# EasyEDA Pro project ProDocument_Schematics_2024-05-18.epro

# Schematic FAB-O-MATIC
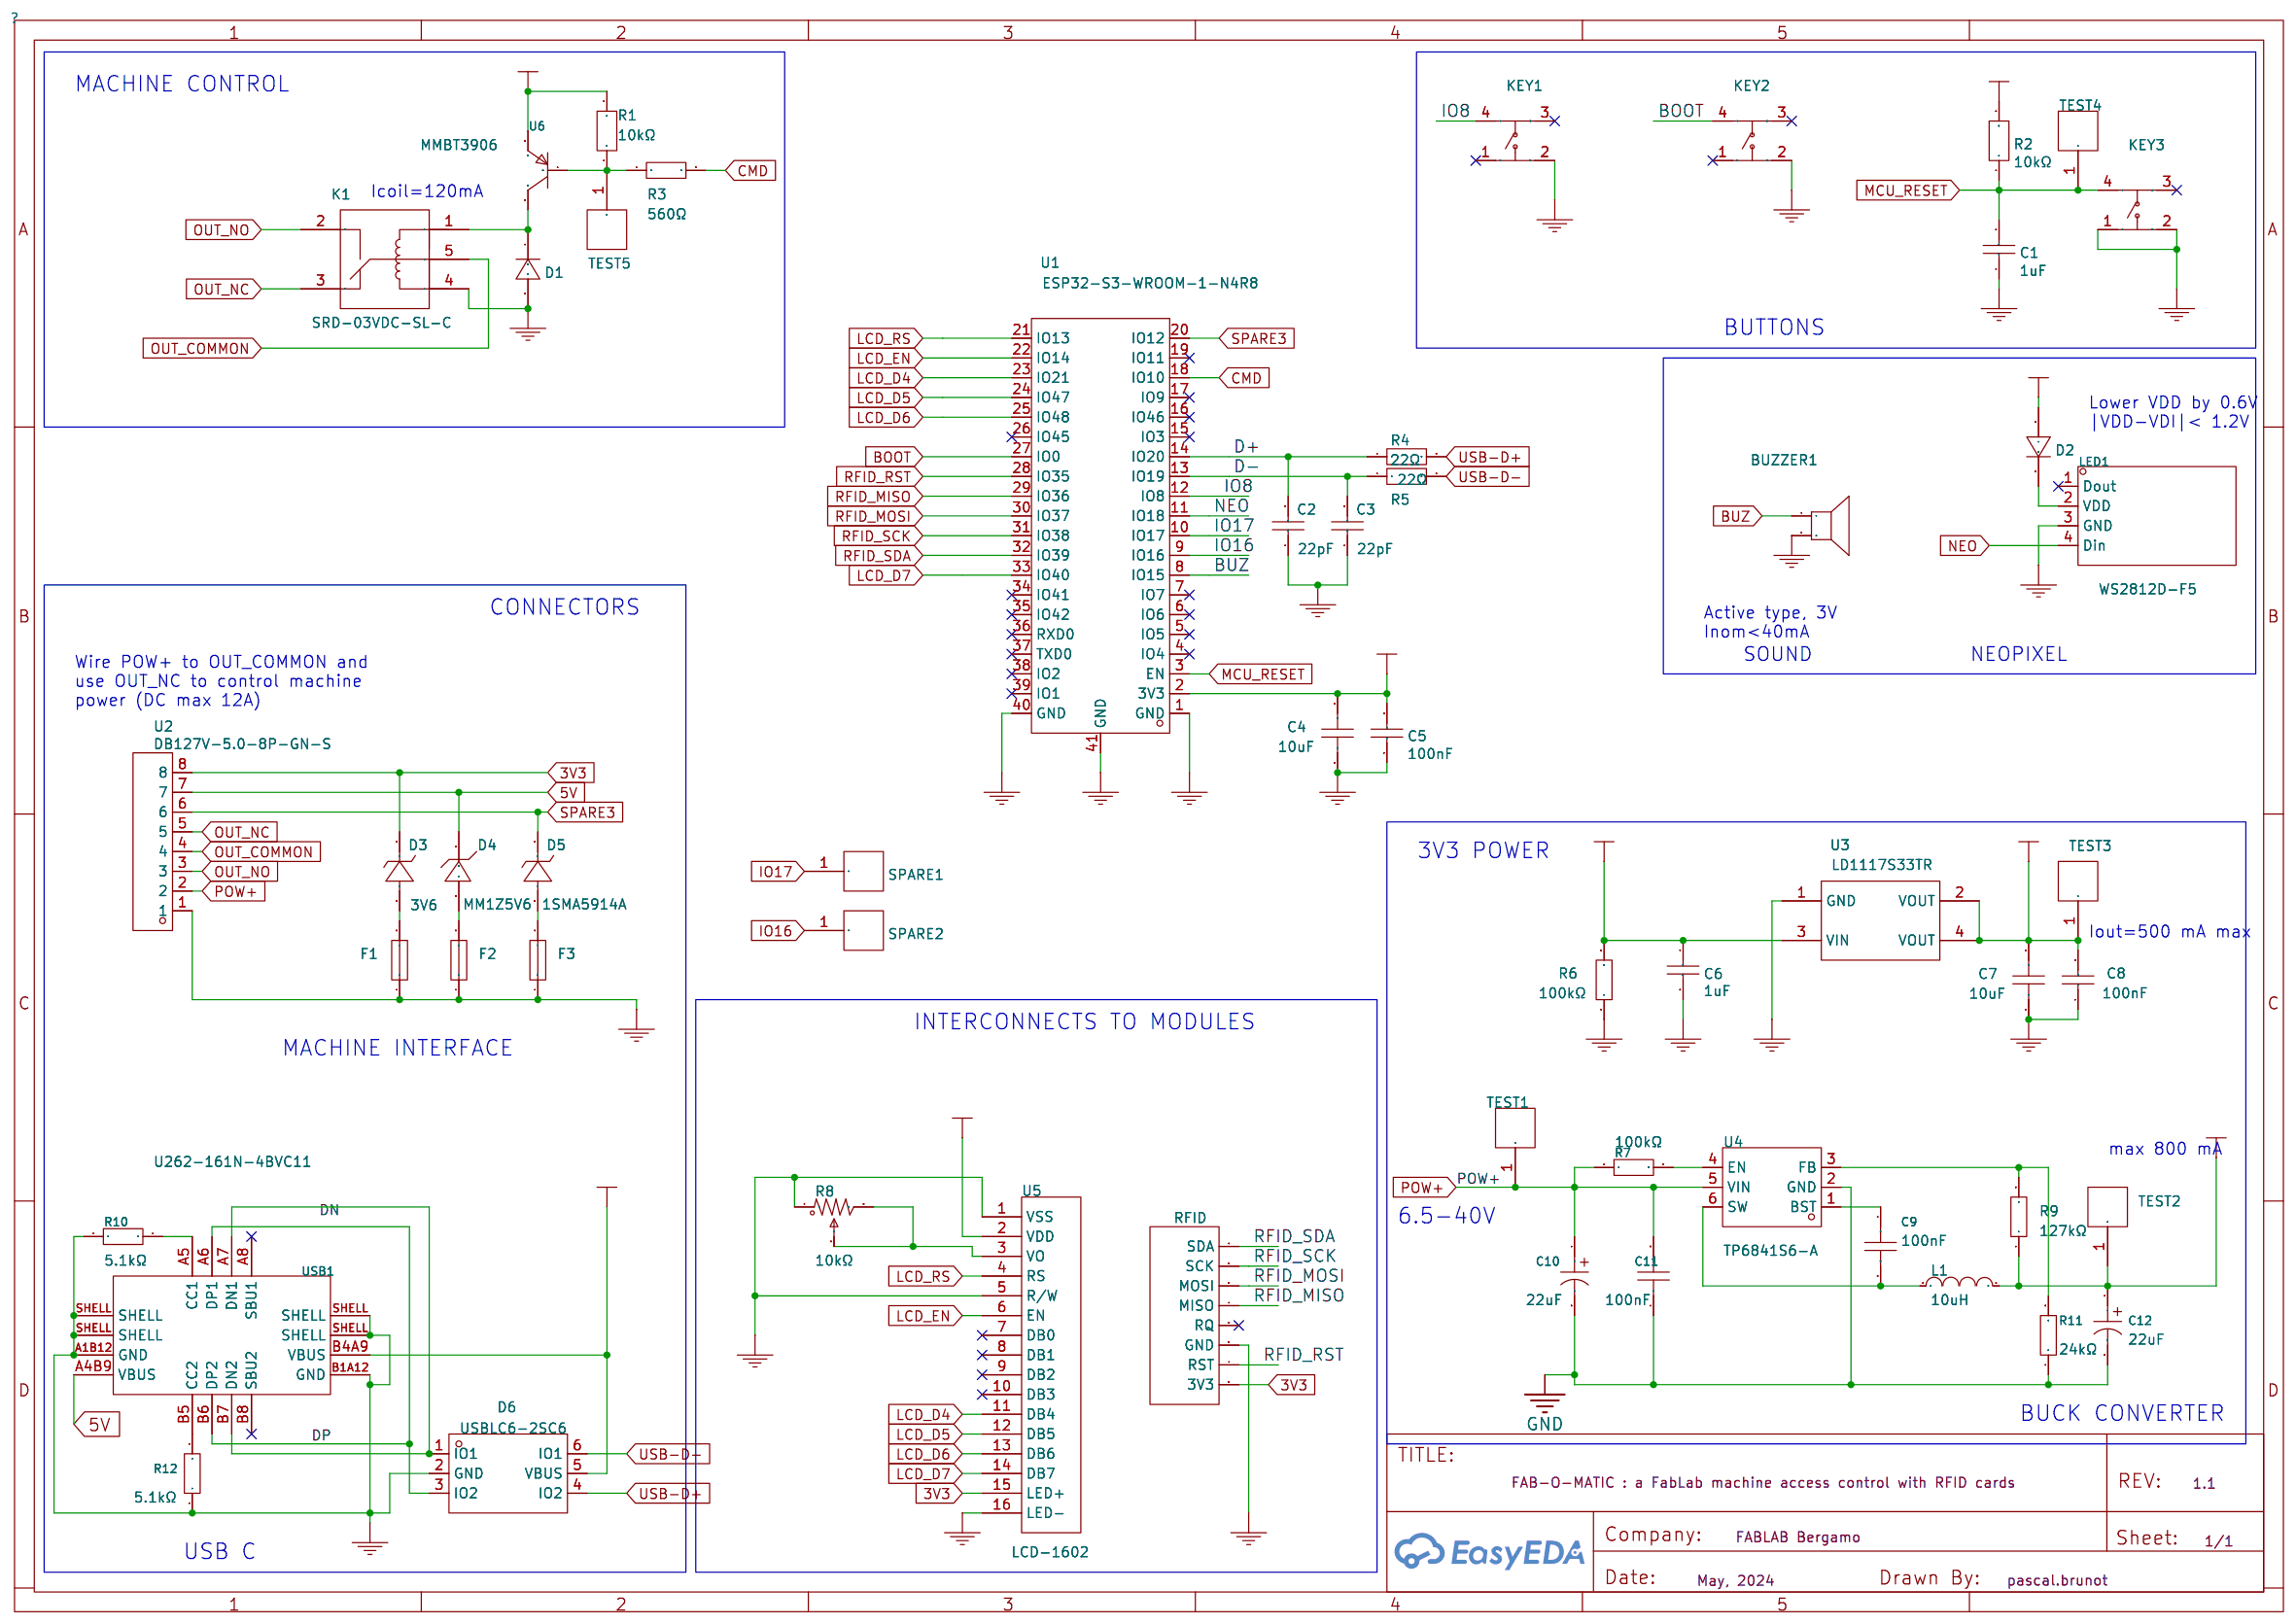
[diagram p0: schematic sheet]

## Parts
BUZZER1  4kHz  [BUZ-TH_BD12.5-P6.50-D0.9]
C1  1uF  [C0805]
C2  22pF  [C0603]
C3  22pF  [C0603]
C4  10uF  [C0805]
C5  100nF  [C0805]
C6  1uF  [C0805]
C7  10uF  [C0805]
C8  100nF  [C0805]
C9  100nF  [C0603]
C10  22uF  [CAP-SMD_BD6.3-L6.6-W6.6-FD]
C11  100nF  [C0603]
C12  22uF  [CAP-SMD_BD6.3-L6.6-W6.6-FD]
D1  SM4007PL  [SOD-123F_L2.8-W1.8-LS3.7-RD]
D2  SM4007PL  [SOD-123F_L2.8-W1.8-LS3.7-RD]
D3  3V6  [SMA_L4.4-W2.6-LS5.1-RD]
D4  MM1Z5V6  [SOD-123_L2.8-W1.8-LS3.7-RD]
D5  1SMA5914A  [SMA_L4.4-W2.6-LS5.1-RD]
D6  USBLC6-2SC6  [SOT-23-6_L2.9-W1.6-P0.95-LS2.8-BL]
F1  1206L016WR  [F1206]
F2  1206L016WR  [F1206]
F3  1206L016WR  [F1206]
K1  SRD-03VDC-SL-C  [RELAY-TH_SRD-03VDC-SL-C]
KEY1  TSA063G60-250  [KEY-SMD_4P-L6.1-W6.1-P4.50-LS9.0]
KEY2  TSA063G60-250  [KEY-SMD_4P-L6.1-W6.1-P4.50-LS9.0]
KEY3  TSA063G60-250  [KEY-SMD_4P-L6.1-W6.1-P4.50-LS9.0]
L1  10uH  [IND-SMD_L4.0-W4.0]
LED1  WS2812D-F5  [LED-TH_4P-BD5.8-P1.30]
P1  RFID  [footprint_17af]
R1  10kΩ  [R0805]
R2  10kΩ  [R0805]
R3  560Ω  [R0805]
R4  22Ω  [R0603]
R5  22Ω  [R0603]
R6  100kΩ  [R0805]
R7  100kΩ  [R0603]
R8  10kΩ  [RES-ADJ-TH_3362P]
R9  127kΩ  [R0603]
R10  5.1kΩ  [R0603]
R11  24kΩ  [R0603]
R12  5.1kΩ  [R0603]
SPARE1  0577-0-43-80-21-27-10-0  [footprint_662d]  (no BOM)
SPARE2  0577-0-43-80-21-27-10-0  [footprint_662d]  (no BOM)
TEST1  0577-0-43-80-21-27-10-0  [footprint_662d]  (no BOM)
TEST2  0577-0-43-80-21-27-10-0  [footprint_662d]  (no BOM)
TEST3  0577-0-43-80-21-27-10-0  [footprint_662d]  (no BOM)
TEST4  0577-0-43-80-21-27-10-0  [footprint_662d]  (no BOM)
TEST5  0577-0-43-80-21-27-10-0  [footprint_662d]  (no BOM)
U1  ESP32-S3-WROOM-1-N4R8  [WIRELM-SMD_ESP32-S3-WROOM-1]
U2  DB127V-5.0-8P-GN-S  [CONN-TH_8P-P5.00_DB127V-5.0-8P-GN-S]
U3  LD1117S33TR  [SOT-223_L6.5-W3.5-P2.30-LS7.0-BR]
U4  TP6841S6-A  [SOT-23-6_L2.9-W1.6-P0.95-LS2.8-BL]
U5  LCD-1602  [footprint_8a57]
U6  MMBT3906  [SOT-23-3_L2.9-W1.3-P1.90-LS2.4-BR]
USB1  U262-161N-4BVC11  [USB-3.1-SMD_U262-161N-4BVC11]

## Library data of the parts
BUZZER1 = SFN-12055PA6.5_C360607: Oscillator Circuit:无源(外部驱动) Technology Type:压电式 Frequency:4kHz Sound Pressure Level (SPL):80dB@5V,10cm Diameter (φD):12.5mm Height:6mm; LCSC Part Name: 压电无源蜂鸣器; Supplier Part: C360607; Manufacturer: S&S(海旭); Manufacturer Part: SFN-12055PA6.5; Supplier Footprint: 插件,D=12.5mm; JLCPCB Part Class: Extended Part; Datasheet: https://atta.szlcsc.com/upload/public/pdf/source/20220225/D801AF3A55A67CFB490E002F7E7725D1.pdf; Supplier: LCSC; Oscillator Circuit: 无源(外部驱动); Technology Type: 压电式; Sound Pressure Level (SPL): 80dB@5V,10cm; Diameter (φD): 12.5mm; Height: 6mm
C1 C6 = CL21B105KBFNNNE: Capacitance: Tolerance:±10% Tolerance:±10% Voltage Rated: Temperature Coefficient:; LCSC Part Name: 1uF ±10% 50V; Supplier Part: C28323; Manufacturer: SAMSUNG(三星); Supplier Footprint: 0805; JLCPCB Part Class: Basic Part; Datasheet: https://atta.szlcsc.com/upload/public/pdf/source/20160218/1457707763339.pdf; Supplier: LCSC; Tolerance: ±10%
C2 C3 = CL10C220JB8NNNC: Capacitance: Tolerance:±5% Tolerance:±5% Voltage Rated: Temperature Coefficient:; LCSC Part Name: 22pF ±5% 50V; Supplier Part: C1653; Manufacturer: SAMSUNG(三星); Supplier Footprint: 0603; JLCPCB Part Class: Basic Part; Datasheet: https://atta.szlcsc.com/upload/public/pdf/source/20160218/1457707763339.pdf; Supplier: LCSC; Tolerance: ±5%
C4 C7 = GRM21BR61H106KE43L: Capacitance: Tolerance:±10% Tolerance:±10% Voltage Rated: Temperature Coefficient:; LCSC Part Name: 10uF ±10% 50V; Supplier Part: C440198; Manufacturer: muRata(村田); Supplier Footprint: 0805; JLCPCB Part Class: Basic Part; Datasheet: https://atta.szlcsc.com/upload/public/pdf/source/20230811/95AAE0C9AF55EDC31B7A4D8B733F534E.pdf; Supplier: LCSC; Tolerance: ±10%
C5 C8 = CL21B104KCFNNNE: Capacitance: Tolerance:±10% Tolerance:±10% Voltage Rated: Temperature Coefficient:; LCSC Part Name: 100nF ±10% 100V; Supplier Part: C28233; Manufacturer: SAMSUNG(三星); Supplier Footprint: 0805; JLCPCB Part Class: Basic Part; Datasheet: https://atta.szlcsc.com/upload/public/pdf/source/20160218/1457707763339.pdf; Supplier: LCSC; Tolerance: ±10%
C9 C11 = CC0603KRX7R9BB104: Capacitance: Tolerance:±10% Tolerance:±10% Voltage Rated: Temperature Coefficient:; LCSC Part Name: 100nF ±10% 50V; Supplier Part: C14663; Manufacturer: YAGEO(国巨); Supplier Footprint: 0603; JLCPCB Part Class: Basic Part; Datasheet: https://atta.szlcsc.com/upload/public/pdf/source/20180910/C282072_33301C7F631E79921B82A8DAC6BCC5B3.pdf; Supplier: LCSC; Tolerance: ±10%
C10 C12 = RVT22UF50V67RV0028: Capacitance: Tolerance:±20% Tolerance:±20% Rated Voltage: Ripple Current:43mA@120Hz Equivalent Series Resistance(ESR):- φD: L: Lifetime @ Temp:2000hrs@105℃ Operating Temperature:-55℃~+105℃ Operating Temperature:-55℃~+105℃; LCSC Part Name: 22uF ±20% 50V; Supplier Part: C2836438; Manufacturer: KNSCHA(科尼盛); Supplier Footprint: SMD,D6.3xL5.4mm; JLCPCB Part Class: Extended Part; Datasheet: https://atta.szlcsc.com/upload/public/pdf/source/20210528/C2836438_BFA13B3627CC6B20ADD0B3BB98082A71.pdf; Supplier: LCSC; Tolerance: ±20%; Ripple Current: 43mA@120Hz; Lifetime @ Temp: 2000hrs@105℃; Operating Temperature: -55℃~+105℃
D1 D2 = SM4007PL_C64898: Diode Configuration: Forward Voltage (Vf@If):1.1V@1A Reverse Voltage (Vr): Average Rectified Current (Io): Reverse Leakage Current:10uA@1kV; LCSC Part Name: 电压:1kV 电流:1A; Supplier Part: C64898; Manufacturer: MDD; Supplier Footprint: SOD-123FL; JLCPCB Part Class: Basic Part; Datasheet: https://atta.szlcsc.com/upload/public/pdf/source/20230823/16A8FDE162764C9B685A3717F2DA3690.pdf; Supplier: LCSC; Forward Voltage (Vf@If): 1.1V@1A; Reverse Leakage Current: 10uA@1kV
D3 D5 = 1SMA5914A: Zener Voltage (Nom):3.6V Reverse Leakage Current (Ir):75uA@1V Power Dissipation:1.5W Tolerance:±5% Tolerance:±5%; Supplier Part: C713621; Manufacturer: LGE(鲁光); Supplier Footprint: DO-214AC(SMA); JLCPCB Part Class: Extended Part; Datasheet: https://atta.szlcsc.com/upload/public/pdf/source/20200826/C688904_8C7260726BAA69A6ECCD821EC44D7B0B.pdf; Supplier: LCSC; Zener Voltage (Nom): 3.6V; Reverse Leakage Current (Ir): 75uA@1V; Power Dissipation: 1.5W; Tolerance: ±5%
D4 = MM1Z5V6_C85210: Diode Configuration:Single Zener Voltage (Nom):5.6V Reverse Leakage Current (Ir):1uA@2.5V Zener Voltage (Range):5.2V~6V Zener Voltage (Range):5.2V~6V Power Dissipation:500mW Zener Impedance (Zzt):80Ω Tolerance:±5% Tolerance:±5%; Supplier Part: C85210; Manufacturer: ST(先科); Supplier Footprint: SOD-123; JLCPCB Part Class: Extended Part; Datasheet: https://atta.szlcsc.com/upload/public/pdf/source/20170914/C118610_1505373983764968880.pdf; Supplier: LCSC; Diode Configuration: Single; Zener Voltage (Nom): 5.6V; Reverse Leakage Current (Ir): 1uA@2.5V; Zener Voltage (Range): 5.2V~6V; Power Dissipation: 500mW; Zener Impedance (Zzt): 80Ω; Tolerance: ±5%
D6 = USBLC6-2SC6_C2827654: polarity:- Reverse Stand-Off Voltage (Vrwm):- Maximum Clamping Voltage:- Peak Pulse Current (Ipp)@10/1000us:- Peak Pulse Power Dissipation (Ppp)@10/1000us:- Breakdown Voltage:- Reverse Leakage Current (Ir):- Operating Temperature:- Operating Temperature:-; LCSC Part Name: ESD，可防30kV静电; Supplier Part: C2827654; Manufacturer: TECH PUBLIC(台舟); Supplier Footprint: SOT-23-6; JLCPCB Part Class: Extended Part; Datasheet: https://atta.szlcsc.com/upload/public/pdf/source/20210810/FBD75DE717D6D97BAC6DD7F2B5C09DCD.pdf; Supplier: LCSC; Type: ESD
F1-F3 = 1206L016WR: Operating Voltage (Max):30V Current Rating (Max):100A Hold Current:160mA Trip Current:370mA Power Dissipation:- Resistance - Initial (Ri) (Min):1.2Ω Resistance - Post Trip (R1) (Max):4.5Ω Maximum Time to Trip:300ms Operating Temperature:-40℃~+85℃ Operatin; LCSC Part Name: 30V 160mA 1206自恢复; Supplier Part: C151161; Manufacturer: Littelfuse(美国力特); Supplier Footprint: 1206; JLCPCB Part Class: Extended Part; Datasheet: https://atta.szlcsc.com/upload/public/pdf/source/20181031/C315893_583812352E070A3E75892B744443DEDE.pdf; Supplier: LCSC; Operating Voltage (Max): 30V; Current Rating (Max): 100A; Hold Current: 160mA; Trip Current: 370mA; Resistance - Initial (Ri) (Min): 1.2Ω; Resistance - Post Trip (R1) (Max): 4.5Ω; Maximum Time to Trip: 300ms; Operating Temperature: -40℃~+85℃
K1 = SRD-03VDC-SL-C: Coil Voltage:3V Contact Form:一组转换:1C(SPDT-转换) Pin Number:5 Contact Rating:- Maximum Switching Voltage:250V@AC Coil Rated Power:360mW Maximum Switching Current:15A Coil Type:无极性-单线圈 Contact Resistance:100mΩ Operate Time:10ms Release Time:10ms; LCSC Part Name: 3V继电器 单刀双掷 蓝色; Supplier Part: C496430; Manufacturer: 松乐; Supplier Footprint: 插件,15.6x19.2mm; JLCPCB Part Class: Extended Part; Datasheet: https://atta.szlcsc.com/upload/public/pdf/source/20211029/0AF1F09028F3938DCCE87F54F358E4BA.pdf; Supplier: LCSC; Coil Voltage: 3V; Contact Form: 一组转换:1C(SPDT-转换); Pin Number: 5; Maximum Switching Voltage: 250V@AC; Coil Rated Power: 360mW; Maximum Switching Current: 15A; Coil Type: 无极性-单线圈; Contact Resistance: 100mΩ; Operate Time: 10ms; Release Time: 10ms
KEY1-KEY3 = TSA063G60-250: Circuit:SPST Actuator Style:Round Button Operating Force:250gf Mounting Style:Brick nogging Switch Length:6.1mm Switch Width:6.1mm Switch Height:6mm Strike Gundam:不带 Contact Current:50mA Voltage Rating (DC):12V Insulation Resistance:100MΩ Actuator/Cap Col; LCSC Part Name: 6.1*6.1*6mm 立贴 轻触开关; Supplier Part: C294566; Manufacturer: BRIGHT(博瑞泰); Supplier Footprint: SMD; JLCPCB Part Class: Extended Part; Datasheet: https://atta.szlcsc.com/upload/public/pdf/source/20181029/C294570_15EFF1F4D215547575AD6307D8A439BB.pdf; Supplier: LCSC; Circuit: SPST; Actuator Style: Round Button; Operating Force: 250gf; Mounting Style: Brick nogging; Switch Length: 6.1mm; Switch Width: 6.1mm; Switch Height: 6mm; Strike Gundam: 不带; Contact Current: 50mA; Voltage Rating (DC): 12V; Insulation Resistance: 100MΩ; Actuator/Cap Color: Black; With Lamp: No; Pin Style: Gull Wing; Mechanical Life: 5万次; Operating Temperature: -25℃~+70℃
L1 = SWPA4030S100MT: Inductance: Tolerance:±20% Tolerance:±20% Rated Current: Saturation Current (Isat):2.4A DC Resistance (DCR): Type:- Ratings:-; LCSC Part Name: 10uH ±20% 2.4A; Supplier Part: C38117; Manufacturer: Sunlord(顺络); Supplier Footprint: SMD; JLCPCB Part Class: Extended Part; Datasheet: https://atta.szlcsc.com/upload/public/pdf/source/20231024/317626D2AA2F8AB4113C1875E432E6E1.pdf; Supplier: LCSC; Tolerance: ±20%; Saturation Current (Isat): 2.4A
LED1 = WS2812D-F5: Lamp Holder Type:5mm圆形灯头; Supplier Part: C190565; Manufacturer: worldsemi; Supplier Footprint: 插件,D=5mm; JLCPCB Part Class: Extended Part; Datasheet: https://atta.szlcsc.com/upload/public/pdf/source/20220418/4832EF9FB0C1B68C1F4176435955B165.pdf; Supplier: LCSC; Lamp Holder Type: 5mm圆形灯头
P1 = RFID: Supplier Part: C27438; Supplier: LCSC; Manufacturer: BOOMELE; Manufacturer Part: Female headerHDR1X8-2.54
R1 R2 = 0805W8F1002T5E: Type:Thick Film Resistors Resistance:10kΩ Tolerance:±1% Tolerance:±1% Power(Watts): Overload Voltage (Max): Temperature Coefficient:±100ppm/℃ Temperature Coefficient:±100ppm/℃ Operating Temperature Range:-55℃~+155℃ Operating Temperature Range:-55℃~+155℃; LCSC Part Name: 10kΩ ±1% 125mW 厚膜电阻; Supplier Part: C17414; Manufacturer: UNI-ROYAL(厚声); Supplier Footprint: 0805; JLCPCB Part Class: Basic Part; Datasheet: https://atta.szlcsc.com/upload/public/pdf/source/20200306/C422600_1E6D84923E4A46A82E41ADD87F860B5C.pdf; Supplier: LCSC; Type: Thick Film Resistors; Tolerance: ±1%; Temperature Coefficient: ±100ppm/℃; Operating Temperature Range: -55℃~+155℃
R3 = 0805W8F5600T5E: Type:Thick Film Resistors Resistance: Tolerance:±1% Tolerance:±1% Power(Watts): Overload Voltage (Max): Temperature Coefficient:±100ppm/℃ Temperature Coefficient:±100ppm/℃ Operating Temperature Range:-55℃~+155℃ Operating Temperature Range:-55℃~+155℃; LCSC Part Name: 560Ω ±1% 125mW 厚膜电阻; Supplier Part: C28636; Manufacturer: UNI-ROYAL(厚声); Supplier Footprint: 0805; JLCPCB Part Class: Basic Part; Datasheet: https://atta.szlcsc.com/upload/public/pdf/source/20200306/C422600_1E6D84923E4A46A82E41ADD87F860B5C.pdf; Supplier: LCSC; Type: Thick Film Resistors; Tolerance: ±1%; Temperature Coefficient: ±100ppm/℃; Operating Temperature Range: -55℃~+155℃
R4 R5 = 0603WAF220JT5E: Type:Thick Film Resistors Resistance:22Ω Tolerance:±1% Tolerance:±1% Power(Watts): Overload Voltage (Max): Temperature Coefficient:±100ppm/℃ Temperature Coefficient:±100ppm/℃ Operating Temperature Range:-55℃~+155℃ Operating Temperature Range:-55℃~+155℃; LCSC Part Name: 22Ω ±1% 100mW 厚膜电阻; Supplier Part: C23345; Manufacturer: UNI-ROYAL(厚声); Supplier Footprint: 0603; JLCPCB Part Class: Basic Part; Datasheet: https://atta.szlcsc.com/upload/public/pdf/source/20200306/C422600_1E6D84923E4A46A82E41ADD87F860B5C.pdf; Supplier: LCSC; Type: Thick Film Resistors; Tolerance: ±1%; Temperature Coefficient: ±100ppm/℃; Operating Temperature Range: -55℃~+155℃; Resistance: 22
R6 = 0805W8F1003T5E: Type:Thick Film Resistors Resistance:100kΩ Tolerance:±1% Tolerance:±1% Power(Watts): Overload Voltage (Max): Temperature Coefficient:±100ppm/℃ Temperature Coefficient:±100ppm/℃ Operating Temperature Range:-55℃~+155℃ Operating Temperature Range:-55℃~+155℃; LCSC Part Name: 100kΩ ±1% 125mW 厚膜电阻; Supplier Part: C149504; Manufacturer: UNI-ROYAL(厚声); Supplier Footprint: 0805; JLCPCB Part Class: Basic Part; Datasheet: https://atta.szlcsc.com/upload/public/pdf/source/20200306/C422600_1E6D84923E4A46A82E41ADD87F860B5C.pdf; Supplier: LCSC; Type: Thick Film Resistors; Tolerance: ±1%; Temperature Coefficient: ±100ppm/℃; Operating Temperature Range: -55℃~+155℃
R7 = 0603WAF1003T5E: Type:Thick Film Resistors Resistance:100kΩ Tolerance:±1% Tolerance:±1% Power(Watts): Overload Voltage (Max): Temperature Coefficient:±100ppm/℃ Temperature Coefficient:±100ppm/℃ Operating Temperature Range:-55℃~+155℃ Operating Temperature Range:-55℃~+155℃; LCSC Part Name: 100kΩ ±1% 100mW 厚膜电阻; Supplier Part: C25803; Manufacturer: UNI-ROYAL(厚声); Supplier Footprint: 0603; JLCPCB Part Class: Basic Part; Datasheet: https://atta.szlcsc.com/upload/public/pdf/source/20200306/C422600_1E6D84923E4A46A82E41ADD87F860B5C.pdf; Supplier: LCSC; Type: Thick Film Resistors; Tolerance: ±1%; Temperature Coefficient: ±100ppm/℃; Operating Temperature Range: -55℃~+155℃
R8 = 3362P-1-103_C118956: Resistance: Tolerance:±10% Tolerance:±10%; LCSC Part Name: 10kΩ ±10%; Supplier Part: C118956; Manufacturer: BOCHEN(博晨); Manufacturer Part: 3362P-1-103; Supplier Footprint: 插件; JLCPCB Part Class: Extended Part; Datasheet: https://atta.szlcsc.com/upload/public/pdf/source/20171114/C118956_15106326650691117445.pdf; Supplier: LCSC; Tolerance: ±10%
R9 = RC0603FR-07127KL: Type:Thick Film Resistors Resistance: Tolerance:±1% Tolerance:±1% Power(Watts): Overload Voltage (Max): Temperature Coefficient:±100ppm/℃ Temperature Coefficient:±100ppm/℃ Operating Temperature Range:-55℃~+155℃ Operating Temperature Range:-55℃~+155℃; LCSC Part Name: 厚膜电阻 127kΩ ±1% 100mW; Supplier Part: C245905; Manufacturer: YAGEO(国巨); Supplier Footprint: 0603; JLCPCB Part Class: Extended Part; Datasheet: https://atta.szlcsc.com/upload/public/pdf/source/20181031/C326976_E9901E35333D136A19B6CE377E889A82.pdf; Supplier: LCSC; Type: Thick Film Resistors; Tolerance: ±1%; Temperature Coefficient: ±100ppm/℃; Operating Temperature Range: -55℃~+155℃
R10 R12 = 0603WAF5101T5E: Type:Thick Film Resistors Resistance:5.1kΩ Tolerance:±1% Tolerance:±1% Power(Watts): Overload Voltage (Max): Temperature Coefficient:±100ppm/℃ Temperature Coefficient:±100ppm/℃ Operating Temperature Range:-55℃~+155℃ Operating Temperature Range:-55℃~+155℃; LCSC Part Name: 5.1kΩ ±1% 100mW 厚膜电阻; Supplier Part: C23186; Manufacturer: UNI-ROYAL(厚声); Supplier Footprint: 0603; JLCPCB Part Class: Basic Part; Datasheet: https://atta.szlcsc.com/upload/public/pdf/source/20200306/C422600_1E6D84923E4A46A82E41ADD87F860B5C.pdf; Supplier: LCSC; Type: Thick Film Resistors; Tolerance: ±1%; Temperature Coefficient: ±100ppm/℃; Operating Temperature Range: -55℃~+155℃
R11 = 0603WAF2402T5E: Type:Thick Film Resistors Resistance:24kΩ Tolerance:±1% Tolerance:±1% Power(Watts): Overload Voltage (Max): Temperature Coefficient:±100ppm/℃ Temperature Coefficient:±100ppm/℃ Operating Temperature Range:-55℃~+155℃ Operating Temperature Range:-55℃~+155℃; LCSC Part Name: 24kΩ ±1% 100mW 厚膜电阻; Supplier Part: C23352; Manufacturer: UNI-ROYAL(厚声); Supplier Footprint: 0603; JLCPCB Part Class: Basic Part; Datasheet: https://atta.szlcsc.com/upload/public/pdf/source/20200306/C422600_1E6D84923E4A46A82E41ADD87F860B5C.pdf; Supplier: LCSC; Type: Thick Film Resistors; Tolerance: ±1%; Temperature Coefficient: ±100ppm/℃; Operating Temperature Range: -55℃~+155℃
SPARE1 SPARE2 TEST1-TEST5 = 0577-0-43-80-21-27-10-0: Supplier: LCSC; Supplier Part: C2895400; Manufacturer: null; JLCPCB Part Class: Extended Part
U1 = ESP32-S3-WROOM-1-N4R8: LCSC Part Name: 通用型Wi-Fi+低功耗蓝牙MCU模组; Supplier Part: C2913200; Manufacturer: ESPRESSIF(乐鑫); Supplier Footprint: SMD,18x25.5mm; JLCPCB Part Class: Extended Part; Datasheet: https://atta.szlcsc.com/upload/public/pdf/source/20220628/A2AC12B3C87735CAEB7EBE2DBE80936C.pdf; Supplier: LCSC; spicePre: U
U2 = DB127V-5.0-8P-GN-S: Structure:1x8P Pitch:5mm Color:Green Mounting Style:Straight Current Rating (Max):15A Voltage Rating (Max):250V Number of Pins:8P Number of Rows:1 Wire Gauge - AWG:14~26 Wire Gauge - AWG:14~26 Wire Gauge - mm2:1.5 Wire Gauge - mm2:1.5 Number of PINs Per R; LCSC Part Name: 5mm 1x8P 排数:1 每排P数:8 直插; Supplier Part: C430626; Manufacturer: DORABO(地博电气); Supplier Footprint: 插件,P=5mm; JLCPCB Part Class: Extended Part; Datasheet: https://atta.szlcsc.com/upload/public/pdf/source/20230106/9CDB472D403F670588C42D375AEF1B30.pdf; Supplier: LCSC; Structure: 1x8P; Pitch: 5mm; Color: Green; Mounting Style: Straight; Current Rating (Max): 15A; Voltage Rating (Max): 250V; Number of Pins: 8P; Number of Rows: 1; Wire Gauge - AWG: 14~26; Wire Gauge - mm2: 1.5; Number of PINs Per Row: 8; Operating Temperature Range: -40℃~+105℃
U3 = LD1117S33TR: Output Type: Maximum Input Voltage:15V Output Voltage:3.3V Output Voltage:3.3V MAX Output Current:800mA Power Supply Rejection Ratio (PSRR):75dB@(120Hz) Dropout Voltage:1.2V@(800mA) standby current:10mA Operating Temperature:0℃~+125℃ Operating Temperature; LCSC Part Name: 输入15V 输出3.3V 800mA; Supplier Part: C86781; Manufacturer: ST(意法半导体); Supplier Footprint: SOT-223; JLCPCB Part Class: Extended Part; Datasheet: https://atta.szlcsc.com/upload/public/pdf/source/20181022/C283467_00098992BB1D287195B66486CE33A2DD.pdf; Supplier: LCSC; Maximum Input Voltage: 15V; Output Voltage: 3.3V; MAX Output Current: 800mA; Power Supply Rejection Ratio (PSRR): 75dB@(120Hz); Dropout Voltage: 1.2V@(800mA); standby current: 10mA; Operating Temperature: 0℃~+125℃; Output Polarity: Positive electrode; Number of Outputs: 1
U4 = TP6841S6-A: Supplier Part: C2844924; Manufacturer: TECH PUBLIC(台舟); Supplier Footprint: SOT-23-6; JLCPCB Part Class: Extended Part; Datasheet: https://atta.szlcsc.com/upload/public/pdf/source/20210709/C2844924_E200F0B809810750A1B5AEDD4B4FD840.pdf; Supplier: LCSC
U5 = LCD-1602: Manufacturer Part: ?
U6 = MMBT3906_C7420354: Transistor Type:PNP Collector Current (Ic):200mA Collector-Emitter Breakdown Voltage (Vceo):40V Power Dissipation (Pd): DC Current Gain (hFE@Ic,Vce):100@10mA,1.0V DC Current Gain (hFE@Ic,Vce):100@10mA,1.0V Transition Frequency (fT):300MHz Collector Cut-Of; LCSC Part Name: 耐压:40V 电流:200mA PNP; Supplier Part: C7420354; Manufacturer: 宏迦橙; Supplier Footprint: SOT-23; JLCPCB Part Class: Extended Part; Datasheet: https://atta.szlcsc.com/upload/public/pdf/source/20231222/C57AF7F09D8B4437DE7730975D81C46C.pdf; Supplier: LCSC; Transistor Type: PNP; Collector Current (Ic): 200mA; Collector-Emitter Breakdown Voltage (Vceo): 40V; DC Current Gain (hFE@Ic,Vce): 100@10mA,1.0V; Transition Frequency (fT): 300MHz; Collector Cut-Off Current (Icbo): 100nA; Collector-Emitter Saturation Voltage (VCE(sat)@Ic,Ib): 300mV@50mA,5.0mA; Operating Temperature: -55℃~+150℃
USB1 = U262-161N-4BVC11: Connector Type:Type-C Standard:USB 3.1 Gender:Female Number of Ports:1 Number of Contacts:16P Mounting Style:卧贴 Current Rating - Power (Max):3A Contact Material:Copper Alloy Contact Plating:Gold Operating Temperature Range:-40℃~+85℃ Operating Temperature; LCSC Part Name: Type-C 母 卧贴; Supplier Part: C319148; Manufacturer: XKB Connectivity(中国星坤); Supplier Footprint: SMD; JLCPCB Part Class: Extended Part; Datasheet: https://atta.szlcsc.com/upload/public/pdf/source/20211015/B478CBA0F1623DA36A6CC6918C49C838.pdf; Supplier: LCSC; Connector Type: Type-C; Standard: USB 3.1; Gender: Female; Number of Ports: 1; Number of Contacts: 16P; Mounting Style: 卧贴; Current Rating - Power (Max): 3A; Contact Material: Copper Alloy; Contact Plating: Gold; Operating Temperature Range: -40℃~+85℃; Soldering Temperature(Max): 260℃

## Nets
3V3: C4.2 C5.2 C7.2 C8.2 D3.1(C) P1.8(3V3) R1.2 R2.2 TEST3.1 U1.2(3V3) U2.8 U3.2(VOUT) U3.4(VOUT) U5.15(LED+) U6.2(E)
5V: C6.1 C12.1 D2.2(A) D4.1(C) D6.5(VBUS) L1.2 R6.2 R9.1 TEST2.1 U2.7 U3.3(VIN) U5.2(VDD) USB1.A4B9(VBUS) USB1.B4A9(VBUS)
GND: BUZZER1.2 C1.1 C2.1 C3.1 C4.1 C5.1 C6.2 C7.1 C8.1 C10.2 C11.1 C12.2 D1.2(A) D6.2(GND) F1.1 F2.1 F3.1 K1.4 KEY1.2 KEY2.2 KEY3.1 KEY3.2 LED1.3(GND) P1.6(GND) R6.1 R8.1 R10.2 R11.1 R12.1 U1.1(GND) U1.40(GND) U1.41(GND) U2.1 U3.1(GND) U4.2(GND) U5.1(VSS) U5.5(R/W) U5.16(LED-) USB1.A1B12(GND) USB1.B1A12(GND) USB1.SHELL
BOOT: KEY2.4 U1.27(IO0)
BUZ: BUZZER1.1 U1.8(IO15)
CMD: R3.2 U1.18(IO10)
D+: C2.2 R4.1 U1.14(IO20)
D-: C3.2 R5.1 U1.13(IO19)
DN: D6.1(IO1) USB1.A7(DN1) USB1.B7(DN2)
DP: D6.3(IO2) USB1.A6(DP1) USB1.B6(DP2)
IO8: KEY1.4 U1.12(IO8)
IO16: SPARE2.1 U1.9(IO16)
IO17: SPARE1.1 U1.10(IO17)
LCD_D4: U1.23(IO21) U5.11(DB4)
LCD_D5: U1.24(IO47) U5.12(DB5)
LCD_D6: U1.25(IO48) U5.13(DB6)
LCD_D7: U1.33(IO40) U5.14(DB7)
LCD_EN: U1.22(IO14) U5.6(EN)
LCD_RS: U1.21(IO13) U5.4(RS)
MCU_RESET: C1.2 KEY3.4 R2.1 TEST4.1 U1.3(EN)
NEO: LED1.4(Din) U1.11(IO18)
OUT_COMMON: K1.5 U2.4
OUT_NC: K1.3 U2.5
OUT_NO: K1.2 U2.3
POW+: C10.1 C11.2 R7.1 TEST1.1 U2.2 U4.5(VIN)
RFID_MISO: P1.4(MISO) U1.29(IO36)
RFID_MOSI: P1.3(MOSI) U1.30(IO37)
RFID_RST: P1.7(RST) U1.28(IO35)
RFID_SCK: P1.2(SCK) U1.31(IO38)
RFID_SDA: P1.1(SDA) U1.32(IO39)
SPARE3: D5.1(C) U1.20(IO12) U2.6
USB-D+: D6.4(IO2) R4.2
USB-D-: D6.6(IO1) R5.2
Net-(C9-1): C9.1 U4.1(BST)
Net-(C9-2): C9.2 L1.1 U4.6(SW)
Net-(D1-1): D1.1(C) K1.1 U6.3(C)
Net-(D2-1): D2.1(C) LED1.2(VDD)
Net-(D3-2): D3.2(A) F1.2
Net-(D4-2): D4.2(A) F2.2
Net-(D5-2): D5.2(A) F3.2
Net-(R1-1): R1.1 R3.1 TEST5.1 U6.1(B)
Net-(R7-2): R7.2 U4.4(EN)
Net-(R8-2): R8.2 R8.3 U5.3(VO)
Net-(R9-2): R9.2 R11.2 U4.3(FB)
Net-(R10-1): R10.1 USB1.A5(CC1)
Net-(R12-2): R12.2 USB1.B5(CC2)

Not connected (* = marked no-connect by the designer): KEY1 1* 3*; KEY2 1* 3*; KEY3 3*; LED1 1(Dout)*; P1 5(RQ)*; U1 4(IO4)* 5(IO5)* 6(IO6)* 7(IO7)* 15(IO3)* 16(IO46)* 17(IO9)* 19(IO11)* 26(IO45)* 34(IO41)* 35(IO42)* 36(RXD0)* 37(TXD0)* 38(IO2)* 39(IO1)*; U5 7(DB0)* 8(DB1)* 9(DB2)* 10(DB3)*; USB1 A8(SBU1)* B8(SBU2)*

## Notes on the sheet
- MACHINE CONTROL
- Icoil=120mA
- BUTTONS
- Lower VDD by 0.6V
  |VDD-VDI|< 1.2V
- Active type, 3V
  Inom<40mA
- CONNECTORS
- Wire POW+ to OUT_COMMON and
  use OUT_NC to control machine
  power (DC max 12A)
- SOUND
- NEOPIXEL
- 3V3 POWER
- Iout=500 mA max
- INTERCONNECTS TO MODULES
- MACHINE INTERFACE
- max 800 mA
- 6.5-40V
- BUCK CONVERTER
- USB C
